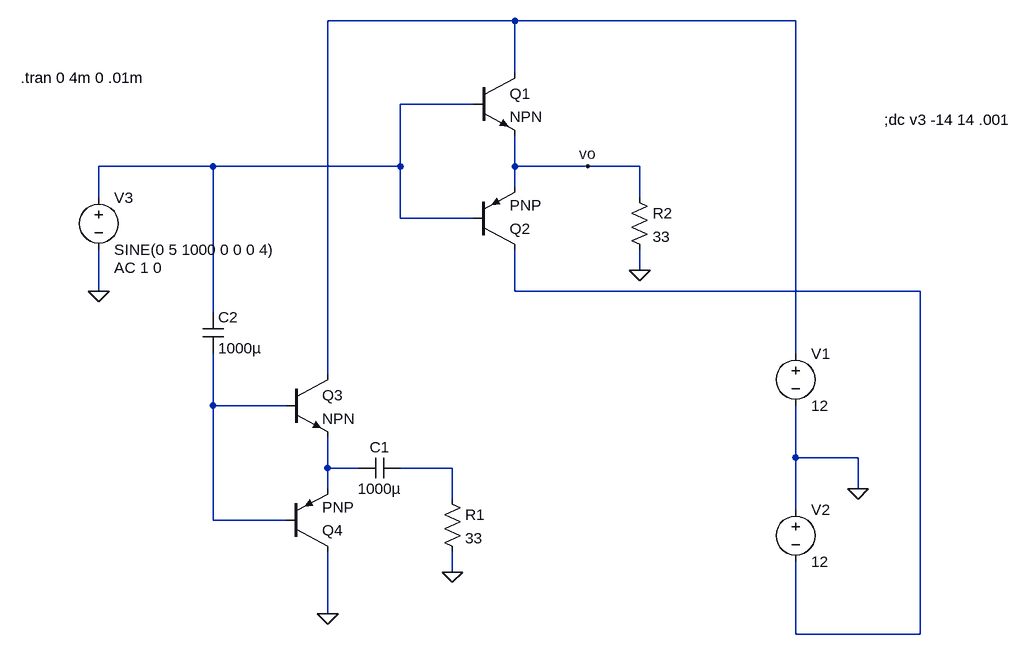
[diagram p0: schematic claseabteo1.asc]
claseabteo1.asc, the LTspice schematic file:
Version 4
SHEET 1 1048 680
WIRE 256 -512 -32 -512
WIRE 688 -512 256 -512
WIRE 256 -432 256 -512
WIRE 192 -384 80 -384
WIRE -208 -288 -384 -288
WIRE 80 -288 80 -384
WIRE 80 -288 -208 -288
WIRE 256 -288 256 -336
WIRE 368 -288 256 -288
WIRE 448 -288 368 -288
WIRE 256 -256 256 -288
WIRE -384 -240 -384 -288
WIRE 448 -240 448 -288
WIRE 80 -208 80 -288
WIRE 192 -208 80 -208
WIRE 448 -128 448 -160
WIRE -384 -96 -384 -160
WIRE 256 -96 256 -160
WIRE 880 -96 256 -96
WIRE -208 -64 -208 -288
WIRE 688 0 688 -512
WIRE -32 32 -32 -512
WIRE -208 80 -208 0
WIRE -96 80 -208 80
WIRE 688 160 688 80
WIRE 784 160 688 160
WIRE -32 176 -32 128
WIRE 16 176 -32 176
WIRE 160 176 80 176
WIRE -32 208 -32 176
WIRE 784 208 784 160
WIRE 160 224 160 176
WIRE 688 240 688 160
WIRE -208 256 -208 80
WIRE -96 256 -208 256
WIRE 160 336 160 304
WIRE -32 400 -32 304
WIRE 688 432 688 320
WIRE 880 432 880 -96
WIRE 880 432 688 432
FLAG 784 208 0
FLAG -384 -96 0
FLAG 448 -128 0
FLAG 368 -288 vo
FLAG 160 336 0
FLAG -32 400 0
SYMBOL voltage 688 -16 R0
WINDOW 123 0 0 Left 2
WINDOW 39 0 0 Left 2
SYMATTR InstName V1
SYMATTR Value 12
SYMBOL voltage 688 224 R0
WINDOW 123 0 0 Left 2
WINDOW 39 0 0 Left 2
SYMATTR InstName V2
SYMATTR Value 12
SYMBOL voltage -384 -256 R0
WINDOW 123 24 124 Left 2
WINDOW 39 0 0 Left 2
SYMATTR Value2 AC 1 0
SYMATTR InstName V3
SYMATTR Value SINE(0 5 1000 0 0 0 4)
SYMBOL res 432 -256 R0
SYMATTR InstName R2
SYMATTR Value 33
SYMBOL npn 192 -432 R0
SYMATTR InstName Q1
SYMBOL pnp 192 -160 M180
SYMATTR InstName Q2
SYMBOL res 144 208 R0
SYMATTR InstName R1
SYMATTR Value 33
SYMBOL npn -96 32 R0
SYMATTR InstName Q3
SYMBOL pnp -96 304 M180
SYMATTR InstName Q4
SYMBOL cap 80 160 R90
WINDOW 0 0 32 VBottom 2
WINDOW 3 32 32 VTop 2
SYMATTR InstName C1
SYMATTR Value 1000µ
SYMBOL cap -224 -64 R0
SYMATTR InstName C2
SYMATTR Value 1000µ
TEXT -504 -424 Left 2 !.tran 0 4m 0 .01m
TEXT 824 -360 Left 2 !;dc v3 -14 14 .001

The netlist it stands for:
* claseabteo1.asc
V1 N001 0 12
V2 0 N003 12
V3 N002 0 SINE(0 5 1000 0 0 0 4) AC 1 0
R2 vo 0 33
Q1 N001 N002 vo 0 NPN
Q2 N003 N002 vo 0 PNP
R1 N006 0 33
Q3 N001 N004 N005 0 NPN
Q4 0 N004 N005 0 PNP
C1 N006 N005 1000µ
C2 N002 N004 1000µ
.model NPN NPN
.model PNP PNP
.lib standard.bjt
.tran 0 4m 0 .01m
;dc v3 -14 14 .001
.backanno
.end